# Altium project PCB_Project 1.PrjPcb
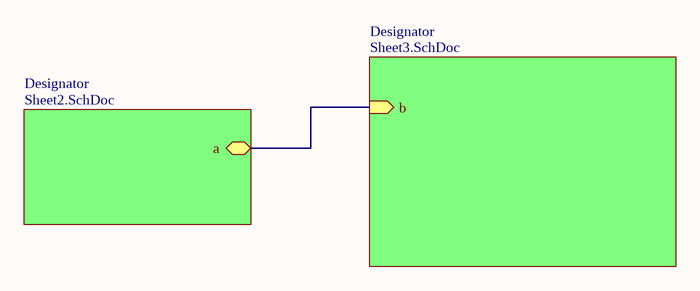
[diagram p0: Sheet1.SchDoc]
3 sheets, 14 parts. Net scope: hierarchical (ports join the sheet entries above them; power ports are global).
Board file: PCB1.PcbDoc
Sheets:
  Sheet1.SchDoc
    Designator = Sheet2.SchDoc
    Designator = Sheet3.SchDoc

## Sheet Sheet1.SchDoc
size A; SheetNumber: 1; SheetTotal: 3

### Sub-sheets
Designator = Sheet2.SchDoc: a (bidir)
Designator = Sheet3.SchDoc: b (in)

### Nets
NetR2_2: sheet Designator/a, sheet Designator/b

## Sheet Sheet2.SchDoc
size A; SheetNumber: 2; SheetTotal: 3
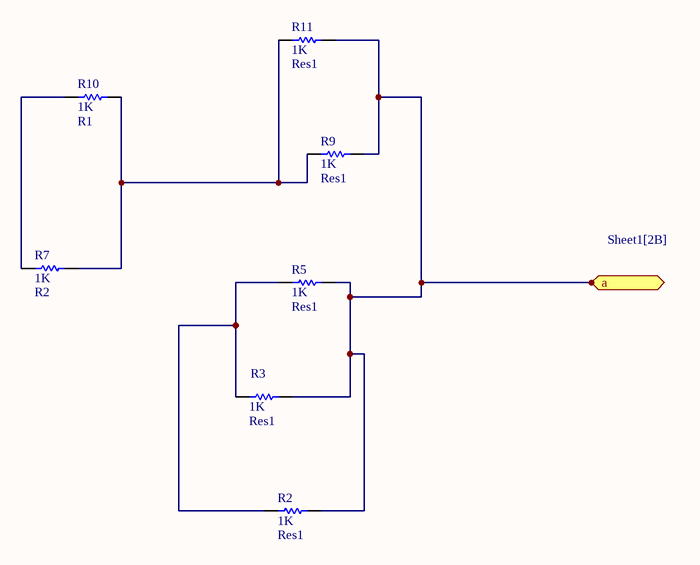
[diagram p1: Sheet2.SchDoc]

### Parts
R2  Res1  value 1K  [AXIAL-0.3]
R3  Res1  value 1K  [AXIAL-0.3]
R5  Res1  value 1K  [AXIAL-0.3]
R7  R2  value 1K  [AXIAL-0.3]
R9  Res1  value 1K  [AXIAL-0.3]
R10  R1  value 1K  [AXIAL-0.3]
R11  Res1  value 1K  [AXIAL-0.3]

### Ports
a (bidir, see Sheet1[2B])

### Nets
NetR2_1: R2.1 R3.1 R5.1
NetR2_2: R2.2 R3.2 R5.2 R9.2 R11.2 ; port a
NetR7_1: R7.1 R10.1
NetR7_2: R7.2 R9.1 R10.2 R11.1

### Library data of the parts
R2 R3 R5 R7 R9-R11 = Res1: Resistor; Published: 8-Jun-2000; LatestRevisionDate: 17-Jul-2002; LatestRevisionNote: Re-released for DXP Platform.; PackageReference: AXIAL-0.3; Publisher: Altium Limited; PackageDescription: Axial Device, Thru-Hole; 2 Leads; 0.3 in Pin Spacing

## Sheet Sheet3.SchDoc
size A; SheetNumber: 3; SheetTotal: 3
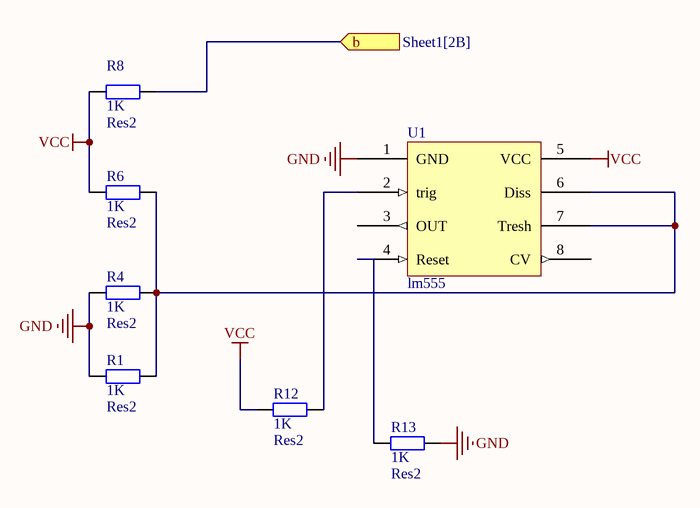
[diagram p2: Sheet3.SchDoc]

### Parts
R1  Res2  value 1K  [AXIAL-0.4]
R4  Res2  value 1K  [AXIAL-0.4]
R6  Res2  value 1K  [AXIAL-0.4]
R8  Res2  value 1K  [AXIAL-0.4]
R12  Res2  value 1K  [AXIAL-0.4]
R13  Res2  value 1K  [AXIAL-0.4]
U1  lm555  [DIP8]

### Ports
b (in, see Sheet1[2B])

### Nets
GND: R1.1 R4.1 R13.2 U1.1(GND)
VCC: R6.1 R8.1 R12.1 U1.5(VCC)
NetR1_2: R1.2 R4.2 R6.2 U1.6(Diss) U1.7(Tresh)
NetR2_2: R8.2 ; port b
NetR12_2: R12.2 U1.2(trig)
NetR13_1: R13.1 U1.4(Reset)

Not connected (* = marked no-connect by the designer): U1 3(OUT) 8(CV)

### Library data of the parts
R1 R4 R6 R8 R12 R13 = Res2: Resistor; Published: 8-Jun-2000; LatestRevisionDate: 17-Jul-2002; LatestRevisionNote: Re-released for DXP Platform.; PackageReference: AXIAL-0.4; Publisher: Altium Limited; PackageDescription: Axial Device, Thru-Hole; 2 Leads; 0.4 in Pin Spacing

## Nets that join several sheets
NetR2_2: Sheet2 (5 pins), Sheet3 (R8.2)